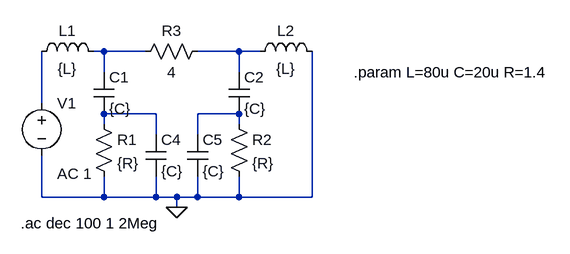
[diagram p0: schematic outputFilter.asc]
outputFilter.asc, the LTspice schematic file:
Version 4
SHEET 1 920 680
WIRE 160 -128 144 -128
WIRE 224 -128 160 -128
WIRE 368 -128 304 -128
WIRE 400 -128 368 -128
WIRE 160 -96 160 -128
WIRE 368 -96 368 -128
WIRE 64 -48 64 -128
WIRE 240 -32 160 -32
WIRE 368 -32 304 -32
WIRE 160 -16 160 -32
WIRE 368 -16 368 -32
WIRE 240 0 240 -32
WIRE 304 0 304 -32
WIRE 64 96 64 32
WIRE 160 96 160 64
WIRE 160 96 64 96
WIRE 240 96 240 64
WIRE 240 96 160 96
WIRE 272 96 240 96
WIRE 304 96 304 64
WIRE 304 96 272 96
WIRE 368 96 368 64
WIRE 368 96 304 96
WIRE 480 96 480 -128
WIRE 480 96 368 96
WIRE 272 112 272 96
FLAG 272 112 0
SYMBOL ind 48 -112 R270
WINDOW 0 32 56 VTop 2
WINDOW 3 5 56 VBottom 2
SYMATTR InstName L1
SYMATTR Value {L}
SYMBOL ind 384 -112 R270
WINDOW 0 32 56 VTop 2
WINDOW 3 5 56 VBottom 2
SYMATTR InstName L2
SYMATTR Value {L}
SYMBOL cap 144 -96 R0
SYMATTR InstName C1
SYMATTR Value {C}
SYMBOL cap 352 -96 R0
SYMATTR InstName C2
SYMATTR Value {C}
SYMBOL res 320 -144 R90
WINDOW 0 0 56 VBottom 2
WINDOW 3 32 56 VTop 2
SYMATTR InstName R3
SYMATTR Value 4
SYMBOL voltage 64 -64 R0
WINDOW 123 24 124 Left 2
WINDOW 39 0 0 Left 0
SYMATTR Value2 AC 1
SYMATTR InstName V1
SYMATTR Value ""
SYMBOL res 144 -32 R0
SYMATTR InstName R1
SYMATTR Value {R}
SYMBOL res 352 -32 R0
SYMATTR InstName R2
SYMATTR Value {R}
SYMBOL cap 224 0 R0
SYMATTR InstName C4
SYMATTR Value {C}
SYMBOL cap 288 0 R0
SYMATTR InstName C5
SYMATTR Value {C}
TEXT 32 136 Left 2 !.ac dec 100 1 2Meg
TEXT 544 -96 Left 2 !.param L=80u C=20u R=1.4

The netlist it stands for:
* outputFilter.asc
L1 N003 N001 {L}
L2 N002 0 {L}
C1 N001 N004 {C}
C2 N002 N005 {C}
R3 N002 N001 4
V1 N003 0 AC 1
R1 N004 0 {R}
R2 N005 0 {R}
C4 N004 0 {C}
C5 N005 0 {C}
.ac dec 100 1 2Meg
.param L=80u C=20u R=1.4
.backanno
.end